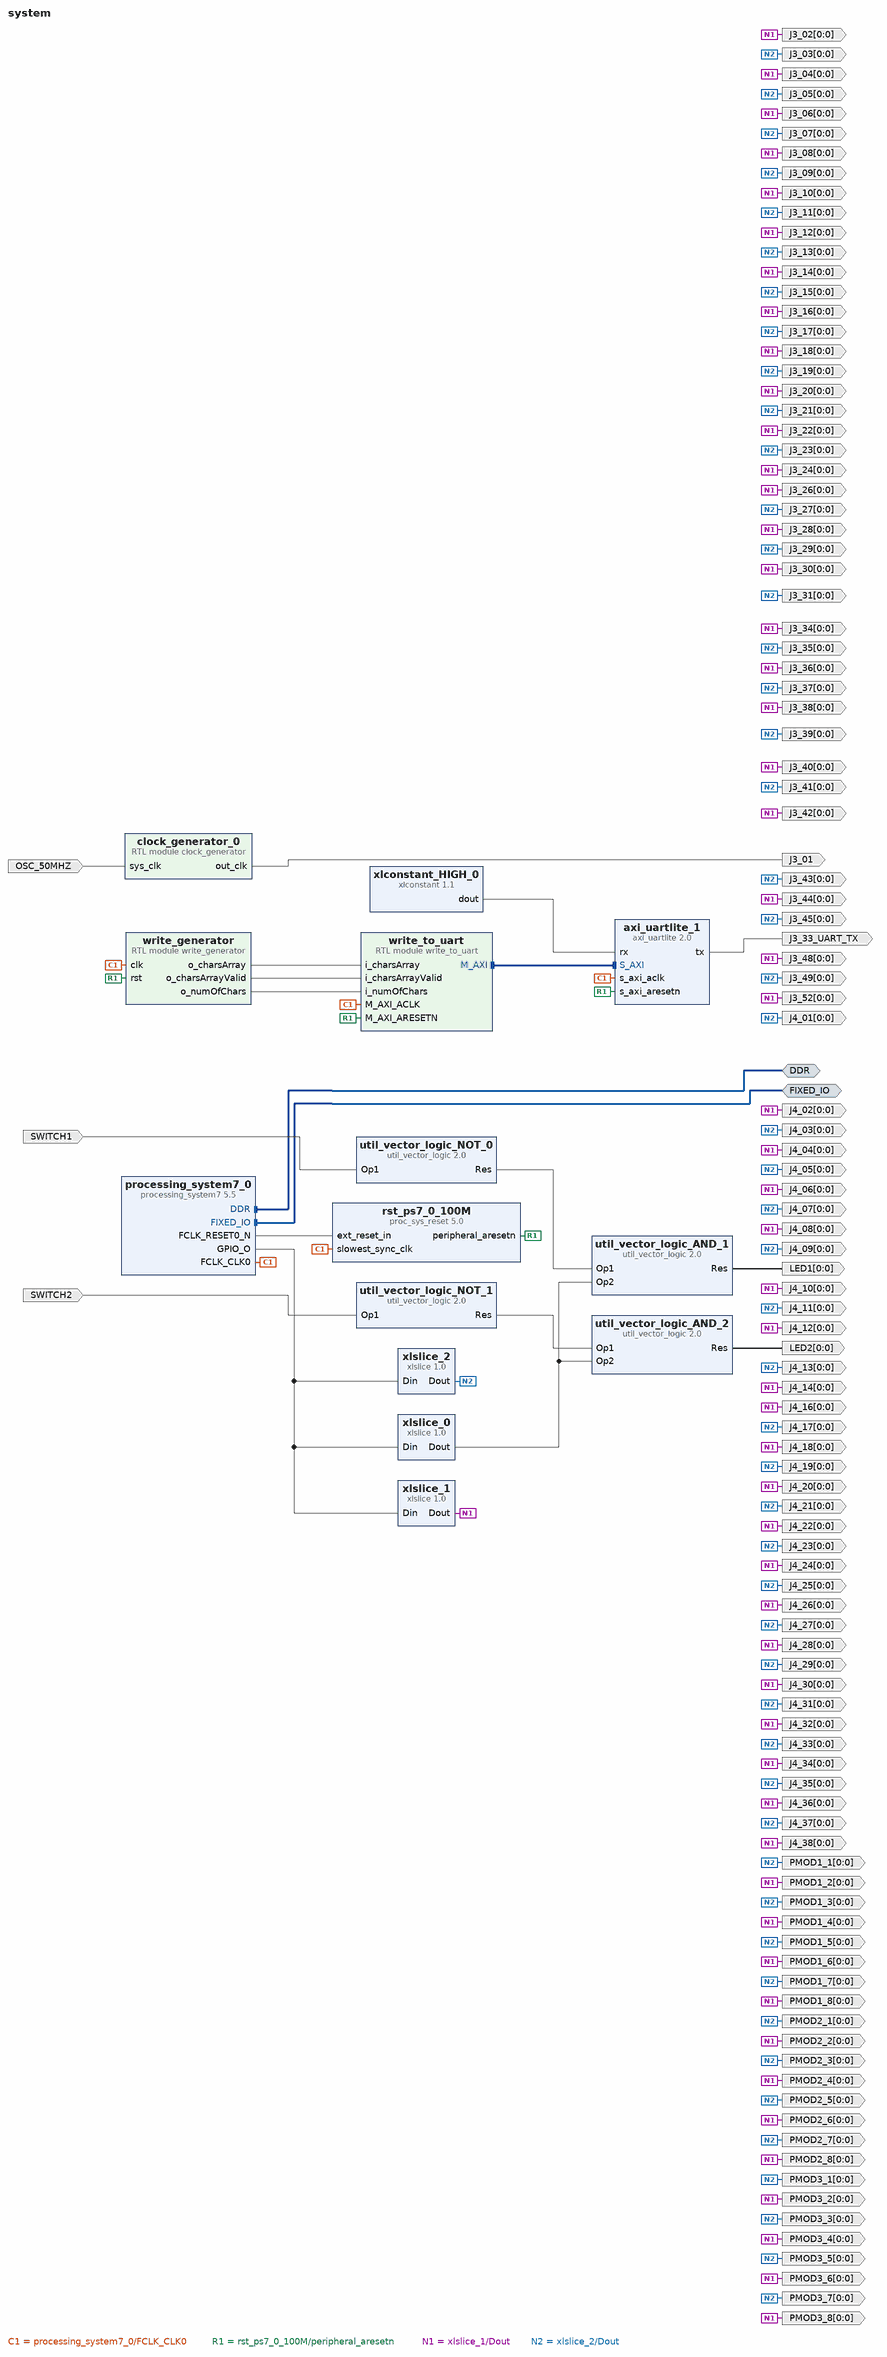
[diagram p0: block diagram of the top level]
# Vivado block design system, xc7z020clg400-1, Vivado 2023.1
create_bd_design system

create_bd_intf_port -mode Master -vlnv xilinx.com:interface:ddrx_rtl:1.0 DDR
create_bd_intf_port -mode Master -vlnv xilinx.com:display_processing_system7:fixedio_rtl:1.0 FIXED_IO
create_bd_port -dir I -type clk OSC_50MHZ
set_property -dict {CONFIG.FREQ_HZ 50000000} [get_bd_ports OSC_50MHZ]
create_bd_port -dir I SWITCH1
create_bd_port -dir I SWITCH2
create_bd_port -dir O -type data J3_33_UART_TX
create_bd_port -dir O J3_01
create_bd_port -dir O -from 0 -to 0 LED1
create_bd_port -dir O -from 0 -to 0 LED2
create_bd_port -dir O -from 0 -to 0 -type data J3_03
create_bd_port -dir O -from 0 -to 0 -type data J3_02
create_bd_port -dir O -from 0 -to 0 -type data J3_04
create_bd_port -dir O -from 0 -to 0 -type data J3_05
create_bd_port -dir O -from 0 -to 0 -type data J3_06
create_bd_port -dir O -from 0 -to 0 -type data J3_07
create_bd_port -dir O -from 0 -to 0 -type data J3_08
create_bd_port -dir O -from 0 -to 0 -type data J3_09
create_bd_port -dir O -from 0 -to 0 -type data J3_10
create_bd_port -dir O -from 0 -to 0 -type data J3_11
create_bd_port -dir O -from 0 -to 0 -type data J3_12
create_bd_port -dir O -from 0 -to 0 -type data J3_13
create_bd_port -dir O -from 0 -to 0 -type data J3_14
create_bd_port -dir O -from 0 -to 0 -type data J3_15
create_bd_port -dir O -from 0 -to 0 -type data J3_16
create_bd_port -dir O -from 0 -to 0 -type data J3_17
create_bd_port -dir O -from 0 -to 0 -type data J3_18
create_bd_port -dir O -from 0 -to 0 -type data J3_19
create_bd_port -dir O -from 0 -to 0 -type data J3_20
create_bd_port -dir O -from 0 -to 0 -type data J3_21
create_bd_port -dir O -from 0 -to 0 -type data J3_22
create_bd_port -dir O -from 0 -to 0 -type data J3_23
create_bd_port -dir O -from 0 -to 0 -type data J3_24
create_bd_port -dir O -from 0 -to 0 -type data J3_27
create_bd_port -dir O -from 0 -to 0 -type data J3_28
create_bd_port -dir O -from 0 -to 0 -type data J3_29
create_bd_port -dir O -from 0 -to 0 -type data J3_30
create_bd_port -dir O -from 0 -to 0 -type data J3_31
create_bd_port -dir O -from 0 -to 0 -type data J3_34
create_bd_port -dir O -from 0 -to 0 -type data J3_35
create_bd_port -dir O -from 0 -to 0 -type data J3_36
create_bd_port -dir O -from 0 -to 0 -type data J3_37
create_bd_port -dir O -from 0 -to 0 -type data J3_38
create_bd_port -dir O -from 0 -to 0 -type data J3_39
create_bd_port -dir O -from 0 -to 0 -type data J3_40
create_bd_port -dir O -from 0 -to 0 -type data J3_41
create_bd_port -dir O -from 0 -to 0 -type data PMOD3_1
create_bd_port -dir O -from 0 -to 0 -type data PMOD3_2
create_bd_port -dir O -from 0 -to 0 -type data PMOD3_3
create_bd_port -dir O -from 0 -to 0 -type data PMOD3_4
create_bd_port -dir O -from 0 -to 0 -type data PMOD3_5
create_bd_port -dir O -from 0 -to 0 -type data PMOD3_6
create_bd_port -dir O -from 0 -to 0 -type data PMOD3_7
create_bd_port -dir O -from 0 -to 0 -type data PMOD3_8
create_bd_port -dir O -from 0 -to 0 -type data J4_01
create_bd_port -dir O -from 0 -to 0 -type data J4_02
create_bd_port -dir O -from 0 -to 0 -type data J4_03
create_bd_port -dir O -from 0 -to 0 -type data J4_04
create_bd_port -dir O -from 0 -to 0 -type data J4_05
create_bd_port -dir O -from 0 -to 0 -type data J4_06
create_bd_port -dir O -from 0 -to 0 -type data J4_07
create_bd_port -dir O -from 0 -to 0 -type data J4_08
create_bd_port -dir O -from 0 -to 0 -type data J4_09
create_bd_port -dir O -from 0 -to 0 -type data J4_10
create_bd_port -dir O -from 0 -to 0 -type data J4_11
create_bd_port -dir O -from 0 -to 0 -type data J4_12
create_bd_port -dir O -from 0 -to 0 -type data J4_13
create_bd_port -dir O -from 0 -to 0 -type data J4_14
create_bd_port -dir O -from 0 -to 0 -type data J4_16
create_bd_port -dir O -from 0 -to 0 -type data J4_17
create_bd_port -dir O -from 0 -to 0 -type data J4_20
create_bd_port -dir O -from 0 -to 0 -type data J4_21
create_bd_port -dir O -from 0 -to 0 -type data J4_22
create_bd_port -dir O -from 0 -to 0 -type data J4_23
create_bd_port -dir O -from 0 -to 0 -type data J4_24
create_bd_port -dir O -from 0 -to 0 -type data J4_25
create_bd_port -dir O -from 0 -to 0 -type data J4_26
create_bd_port -dir O -from 0 -to 0 -type data J4_27
create_bd_port -dir O -from 0 -to 0 -type data J4_28
create_bd_port -dir O -from 0 -to 0 -type data J4_29
create_bd_port -dir O -from 0 -to 0 -type data J4_30
create_bd_port -dir O -from 0 -to 0 -type data J4_31
create_bd_port -dir O -from 0 -to 0 -type data J4_32
create_bd_port -dir O -from 0 -to 0 -type data J4_33
create_bd_port -dir O -from 0 -to 0 -type data PMOD1_1
create_bd_port -dir O -from 0 -to 0 -type data PMOD1_2
create_bd_port -dir O -from 0 -to 0 -type data PMOD1_3
create_bd_port -dir O -from 0 -to 0 -type data PMOD1_4
create_bd_port -dir O -from 0 -to 0 -type data PMOD1_5
create_bd_port -dir O -from 0 -to 0 -type data PMOD1_6
create_bd_port -dir O -from 0 -to 0 -type data PMOD1_7
create_bd_port -dir O -from 0 -to 0 -type data PMOD1_8
create_bd_port -dir O -from 0 -to 0 -type data PMOD2_1
create_bd_port -dir O -from 0 -to 0 -type data PMOD2_2
create_bd_port -dir O -from 0 -to 0 -type data PMOD2_3
create_bd_port -dir O -from 0 -to 0 -type data PMOD2_4
create_bd_port -dir O -from 0 -to 0 -type data PMOD2_5
create_bd_port -dir O -from 0 -to 0 -type data PMOD2_6
create_bd_port -dir O -from 0 -to 0 -type data PMOD2_7
create_bd_port -dir O -from 0 -to 0 -type data PMOD2_8
create_bd_port -dir O -from 0 -to 0 -type data J3_26
create_bd_port -dir O -from 0 -to 0 -type data J3_42
create_bd_port -dir O -from 0 -to 0 -type data J3_43
create_bd_port -dir O -from 0 -to 0 -type data J3_44
create_bd_port -dir O -from 0 -to 0 -type data J3_45
create_bd_port -dir O -from 0 -to 0 -type data J3_48
create_bd_port -dir O -from 0 -to 0 -type data J3_49
create_bd_port -dir O -from 0 -to 0 -type data J3_52
create_bd_port -dir O -from 0 -to 0 -type data J4_18
create_bd_port -dir O -from 0 -to 0 -type data J4_19
create_bd_port -dir O -from 0 -to 0 -type data J4_34
create_bd_port -dir O -from 0 -to 0 -type data J4_35
create_bd_port -dir O -from 0 -to 0 -type data J4_36
create_bd_port -dir O -from 0 -to 0 -type data J4_37
create_bd_port -dir O -from 0 -to 0 -type data J4_38

create_bd_cell -type ip -vlnv xilinx.com:ip:axi_uartlite:2.0 axi_uartlite_1
set_property -dict {CONFIG.C_BAUDRATE 9600} [get_bd_cells axi_uartlite_1]
create_bd_cell -type module -reference clock_generator clock_generator_0
set_property -dict {CONFIG.TICS_IN_PERID 10000} [get_bd_cells clock_generator_0]
create_bd_cell -type ip -vlnv xilinx.com:ip:processing_system7:5.5 processing_system7_0
set_property -dict [list \
  CONFIG.PCW_APU_PERIPHERAL_FREQMHZ 667 \
  CONFIG.PCW_ENET0_ENET0_IO {MIO 16 .. 27} \
  CONFIG.PCW_ENET0_GRP_MDIO_ENABLE 1 \
  CONFIG.PCW_ENET0_GRP_MDIO_IO {MIO 52 .. 53} \
  CONFIG.PCW_ENET0_PERIPHERAL_ENABLE 1 \
  CONFIG.PCW_ENET0_RESET_ENABLE 0 \
  CONFIG.PCW_ENET_RESET_ENABLE 1 \
  CONFIG.PCW_ENET_RESET_SELECT {Share reset pin} \
  CONFIG.PCW_FPGA0_PERIPHERAL_FREQMHZ 100 \
  CONFIG.PCW_FPGA1_PERIPHERAL_FREQMHZ 100 \
  CONFIG.PCW_FPGA2_PERIPHERAL_FREQMHZ 33.333333 \
  CONFIG.PCW_GPIO_EMIO_GPIO_ENABLE 1 \
  CONFIG.PCW_GPIO_EMIO_GPIO_IO 3 \
  CONFIG.PCW_GPIO_EMIO_GPIO_WIDTH 3 \
  CONFIG.PCW_GPIO_MIO_GPIO_ENABLE 1 \
  CONFIG.PCW_GPIO_MIO_GPIO_IO MIO \
  CONFIG.PCW_GPIO_PERIPHERAL_ENABLE 1 \
  CONFIG.PCW_I2C_RESET_ENABLE 0 \
  CONFIG.PCW_PERIPHERAL_BOARD_PRESET part0 \
  CONFIG.PCW_PRESET_BANK1_VOLTAGE {LVCMOS 1.8V} \
  CONFIG.PCW_QSPI_GRP_FBCLK_ENABLE 1 \
  CONFIG.PCW_QSPI_GRP_FBCLK_IO {MIO 8} \
  CONFIG.PCW_QSPI_GRP_SINGLE_SS_ENABLE 1 \
  CONFIG.PCW_QSPI_GRP_SINGLE_SS_IO {MIO 1 .. 6} \
  CONFIG.PCW_QSPI_PERIPHERAL_ENABLE 1 \
  CONFIG.PCW_QSPI_QSPI_IO {MIO 1 .. 6} \
  CONFIG.PCW_SD0_GRP_CD_ENABLE 1 \
  CONFIG.PCW_SD0_GRP_CD_IO {MIO 46} \
  CONFIG.PCW_SD0_GRP_WP_ENABLE 1 \
  CONFIG.PCW_SD0_GRP_WP_IO {MIO 50} \
  CONFIG.PCW_SD0_PERIPHERAL_ENABLE 1 \
  CONFIG.PCW_SD0_SD0_IO {MIO 40 .. 45} \
  CONFIG.PCW_SDIO_PERIPHERAL_FREQMHZ 25 \
  CONFIG.PCW_SINGLE_QSPI_DATA_MODE x4 \
  CONFIG.PCW_TTC0_PERIPHERAL_ENABLE 1 \
  CONFIG.PCW_TTC0_TTC0_IO EMIO \
  CONFIG.PCW_UART1_PERIPHERAL_ENABLE 1 \
  CONFIG.PCW_UART1_UART1_IO {MIO 48 .. 49} \
  CONFIG.PCW_UART_PERIPHERAL_FREQMHZ 50 \
  CONFIG.PCW_UIPARAM_DDR_FREQ_MHZ 533.333333 \
  CONFIG.PCW_UIPARAM_DDR_PARTNO {MT41K256M16 RE-125} \
  CONFIG.PCW_USB0_PERIPHERAL_ENABLE 1 \
  CONFIG.PCW_USB0_RESET_ENABLE 1 \
  CONFIG.PCW_USB0_RESET_IO {MIO 7} \
  CONFIG.PCW_USB0_USB0_IO {MIO 28 .. 39} \
  CONFIG.PCW_USB_RESET_ENABLE 1 \
  CONFIG.PCW_USB_RESET_SELECT {Share reset pin} \
  CONFIG.PCW_USE_M_AXI_GP0 0 \
] [get_bd_cells processing_system7_0]
# 493 more settings of processing_system7_0 are not shown: defaults, MIO pin electricals, DDR timing, and values the tool derives
create_bd_cell -type ip -vlnv xilinx.com:ip:proc_sys_reset:5.0 rst_ps7_0_100M
create_bd_cell -type ip -vlnv xilinx.com:ip:util_vector_logic:2.0 util_vector_logic_NOT_0
set_property -dict {CONFIG.C_OPERATION not CONFIG.C_SIZE 1} [get_bd_cells util_vector_logic_NOT_0]
create_bd_cell -type ip -vlnv xilinx.com:ip:util_vector_logic:2.0 util_vector_logic_AND_1
set_property -dict {CONFIG.C_SIZE 1} [get_bd_cells util_vector_logic_AND_1]
create_bd_cell -type ip -vlnv xilinx.com:ip:util_vector_logic:2.0 util_vector_logic_AND_2
set_property -dict {CONFIG.C_SIZE 1} [get_bd_cells util_vector_logic_AND_2]
create_bd_cell -type ip -vlnv xilinx.com:ip:util_vector_logic:2.0 util_vector_logic_NOT_1
set_property -dict {CONFIG.C_OPERATION not CONFIG.C_SIZE 1} [get_bd_cells util_vector_logic_NOT_1]
create_bd_cell -type module -reference write_generator write_generator
create_bd_cell -type module -reference write_to_uart write_to_uart
create_bd_cell -type ip -vlnv xilinx.com:ip:xlconstant:1.1 xlconstant_HIGH_0
set_property -dict {CONFIG.CONST_VAL 1} [get_bd_cells xlconstant_HIGH_0]
create_bd_cell -type ip -vlnv xilinx.com:ip:xlslice:1.0 xlslice_0
set_property -dict {CONFIG.DIN_FROM 0 CONFIG.DIN_TO 0 CONFIG.DIN_WIDTH 3 CONFIG.DOUT_WIDTH 1} [get_bd_cells xlslice_0]
create_bd_cell -type ip -vlnv xilinx.com:ip:xlslice:1.0 xlslice_1
set_property -dict {CONFIG.DIN_FROM 1 CONFIG.DIN_TO 1 CONFIG.DIN_WIDTH 3 CONFIG.DOUT_WIDTH 1} [get_bd_cells xlslice_1]
create_bd_cell -type ip -vlnv xilinx.com:ip:xlslice:1.0 xlslice_2
set_property -dict {CONFIG.DIN_FROM 2 CONFIG.DIN_TO 2 CONFIG.DIN_WIDTH 3 CONFIG.DOUT_WIDTH 1} [get_bd_cells xlslice_2]

# ---- connections ----

connect_bd_intf_net [get_bd_intf_ports DDR] [get_bd_intf_pins processing_system7_0/DDR]
connect_bd_intf_net [get_bd_intf_ports FIXED_IO] [get_bd_intf_pins processing_system7_0/FIXED_IO]
connect_bd_intf_net [get_bd_intf_pins write_to_uart/M_AXI] [get_bd_intf_pins axi_uartlite_1/S_AXI]
connect_bd_net [get_bd_ports OSC_50MHZ] [get_bd_pins clock_generator_0/sys_clk]
connect_bd_net -net SWITCH1_1 [get_bd_ports SWITCH1] [get_bd_pins util_vector_logic_NOT_0/Op1]
connect_bd_net -net SWITCH2_1 [get_bd_ports SWITCH2] [get_bd_pins util_vector_logic_NOT_1/Op1]
connect_bd_net [get_bd_pins axi_uartlite_1/tx] [get_bd_ports J3_33_UART_TX]
connect_bd_net [get_bd_pins clock_generator_0/out_clk] [get_bd_ports J3_01]
connect_bd_net [get_bd_pins processing_system7_0/FCLK_CLK0] \
  [get_bd_pins axi_uartlite_1/s_axi_aclk] [get_bd_pins rst_ps7_0_100M/slowest_sync_clk] [get_bd_pins write_generator/clk] \
  [get_bd_pins write_to_uart/M_AXI_ACLK]
connect_bd_net [get_bd_pins processing_system7_0/FCLK_RESET0_N] [get_bd_pins rst_ps7_0_100M/ext_reset_in]
connect_bd_net [get_bd_pins processing_system7_0/GPIO_O] [get_bd_pins xlslice_0/Din] [get_bd_pins xlslice_1/Din] [get_bd_pins xlslice_2/Din]
connect_bd_net [get_bd_pins rst_ps7_0_100M/peripheral_aresetn] \
  [get_bd_pins axi_uartlite_1/s_axi_aresetn] [get_bd_pins write_generator/rst] [get_bd_pins write_to_uart/M_AXI_ARESETN]
connect_bd_net -net util_vector_logic_0_Res [get_bd_pins util_vector_logic_NOT_0/Res] [get_bd_pins util_vector_logic_AND_1/Op1]
connect_bd_net [get_bd_pins util_vector_logic_AND_1/Res] [get_bd_ports LED1]
connect_bd_net [get_bd_pins util_vector_logic_AND_2/Res] [get_bd_ports LED2]
connect_bd_net [get_bd_pins util_vector_logic_NOT_1/Res] [get_bd_pins util_vector_logic_AND_2/Op1]
connect_bd_net -net write_generator_0_o_charsArray [get_bd_pins write_generator/o_charsArray] [get_bd_pins write_to_uart/i_charsArray]
connect_bd_net -net write_generator_0_o_charsArrayValid [get_bd_pins write_generator/o_charsArrayValid] [get_bd_pins write_to_uart/i_charsArrayValid]
connect_bd_net [get_bd_pins write_generator/o_numOfChars] [get_bd_pins write_to_uart/i_numOfChars]
connect_bd_net -net xlconstant_0_dout [get_bd_pins xlconstant_HIGH_0/dout] [get_bd_pins axi_uartlite_1/rx]
connect_bd_net [get_bd_pins xlslice_0/Dout] [get_bd_pins util_vector_logic_AND_1/Op2] [get_bd_pins util_vector_logic_AND_2/Op2]
connect_bd_net [get_bd_pins xlslice_1/Dout] \
  [get_bd_ports J3_02] [get_bd_ports J3_04] [get_bd_ports J3_06] [get_bd_ports J3_08] [get_bd_ports J3_10] \
  [get_bd_ports J3_12] [get_bd_ports J3_14] [get_bd_ports J3_16] [get_bd_ports J3_18] [get_bd_ports J3_20] \
  [get_bd_ports J3_22] [get_bd_ports J3_24] [get_bd_ports J3_28] [get_bd_ports J3_30] [get_bd_ports J3_34] \
  [get_bd_ports J3_36] [get_bd_ports J3_38] [get_bd_ports J3_40] [get_bd_ports PMOD3_2] [get_bd_ports PMOD3_4] \
  [get_bd_ports PMOD3_6] [get_bd_ports PMOD3_8] [get_bd_ports J4_02] [get_bd_ports J4_04] [get_bd_ports J4_06] \
  [get_bd_ports J4_08] [get_bd_ports J4_10] [get_bd_ports J4_12] [get_bd_ports J4_14] [get_bd_ports J4_16] \
  [get_bd_ports J4_20] [get_bd_ports J4_22] [get_bd_ports J4_24] [get_bd_ports J4_26] [get_bd_ports J4_28] \
  [get_bd_ports J4_30] [get_bd_ports J4_32] [get_bd_ports PMOD1_2] [get_bd_ports PMOD1_4] [get_bd_ports PMOD1_6] \
  [get_bd_ports PMOD1_8] [get_bd_ports PMOD2_2] [get_bd_ports PMOD2_4] [get_bd_ports PMOD2_6] [get_bd_ports PMOD2_8] \
  [get_bd_ports J3_26] [get_bd_ports J3_42] [get_bd_ports J3_44] [get_bd_ports J3_48] [get_bd_ports J3_52] \
  [get_bd_ports J4_18] [get_bd_ports J4_34] [get_bd_ports J4_36] [get_bd_ports J4_38]
connect_bd_net [get_bd_pins xlslice_2/Dout] \
  [get_bd_ports J3_03] [get_bd_ports J3_05] [get_bd_ports J3_07] [get_bd_ports J3_09] [get_bd_ports J3_11] \
  [get_bd_ports J3_13] [get_bd_ports J3_15] [get_bd_ports J3_17] [get_bd_ports J3_19] [get_bd_ports J3_21] \
  [get_bd_ports J3_23] [get_bd_ports J3_27] [get_bd_ports J3_29] [get_bd_ports J3_31] [get_bd_ports J3_35] \
  [get_bd_ports J3_37] [get_bd_ports J3_39] [get_bd_ports J3_41] [get_bd_ports PMOD3_1] [get_bd_ports PMOD3_3] \
  [get_bd_ports PMOD3_5] [get_bd_ports PMOD3_7] [get_bd_ports J4_01] [get_bd_ports J4_03] [get_bd_ports J4_05] \
  [get_bd_ports J4_07] [get_bd_ports J4_09] [get_bd_ports J4_11] [get_bd_ports J4_13] [get_bd_ports J4_17] \
  [get_bd_ports J4_21] [get_bd_ports J4_23] [get_bd_ports J4_25] [get_bd_ports J4_27] [get_bd_ports J4_29] \
  [get_bd_ports J4_31] [get_bd_ports J4_33] [get_bd_ports PMOD1_1] [get_bd_ports PMOD1_3] [get_bd_ports PMOD1_5] \
  [get_bd_ports PMOD1_7] [get_bd_ports PMOD2_1] [get_bd_ports PMOD2_3] [get_bd_ports PMOD2_5] [get_bd_ports PMOD2_7] \
  [get_bd_ports J3_43] [get_bd_ports J3_45] [get_bd_ports J3_49] [get_bd_ports J4_19] [get_bd_ports J4_35] \
  [get_bd_ports J4_37]

set_property USER_COMMENTS.comment_0 {Reduces 50 MHz input to 5 kHz output.} [current_bd_design]

validate_bd_design
save_bd_design
